# Altium schematic sheet Battery Manager.SchDoc: Battery Manager
size Tabloid; ApprovedBy: NA; CompanyName: Cospan Design LLC; DrawnBy: Dave McCoy; Engineer: Dave McCoy; DocumentNumber: 18; Revision: A; SheetNumber: 18; SheetTotal: 20; Client: Public; ProjectPrettyName: Enigma; Project: Enigma
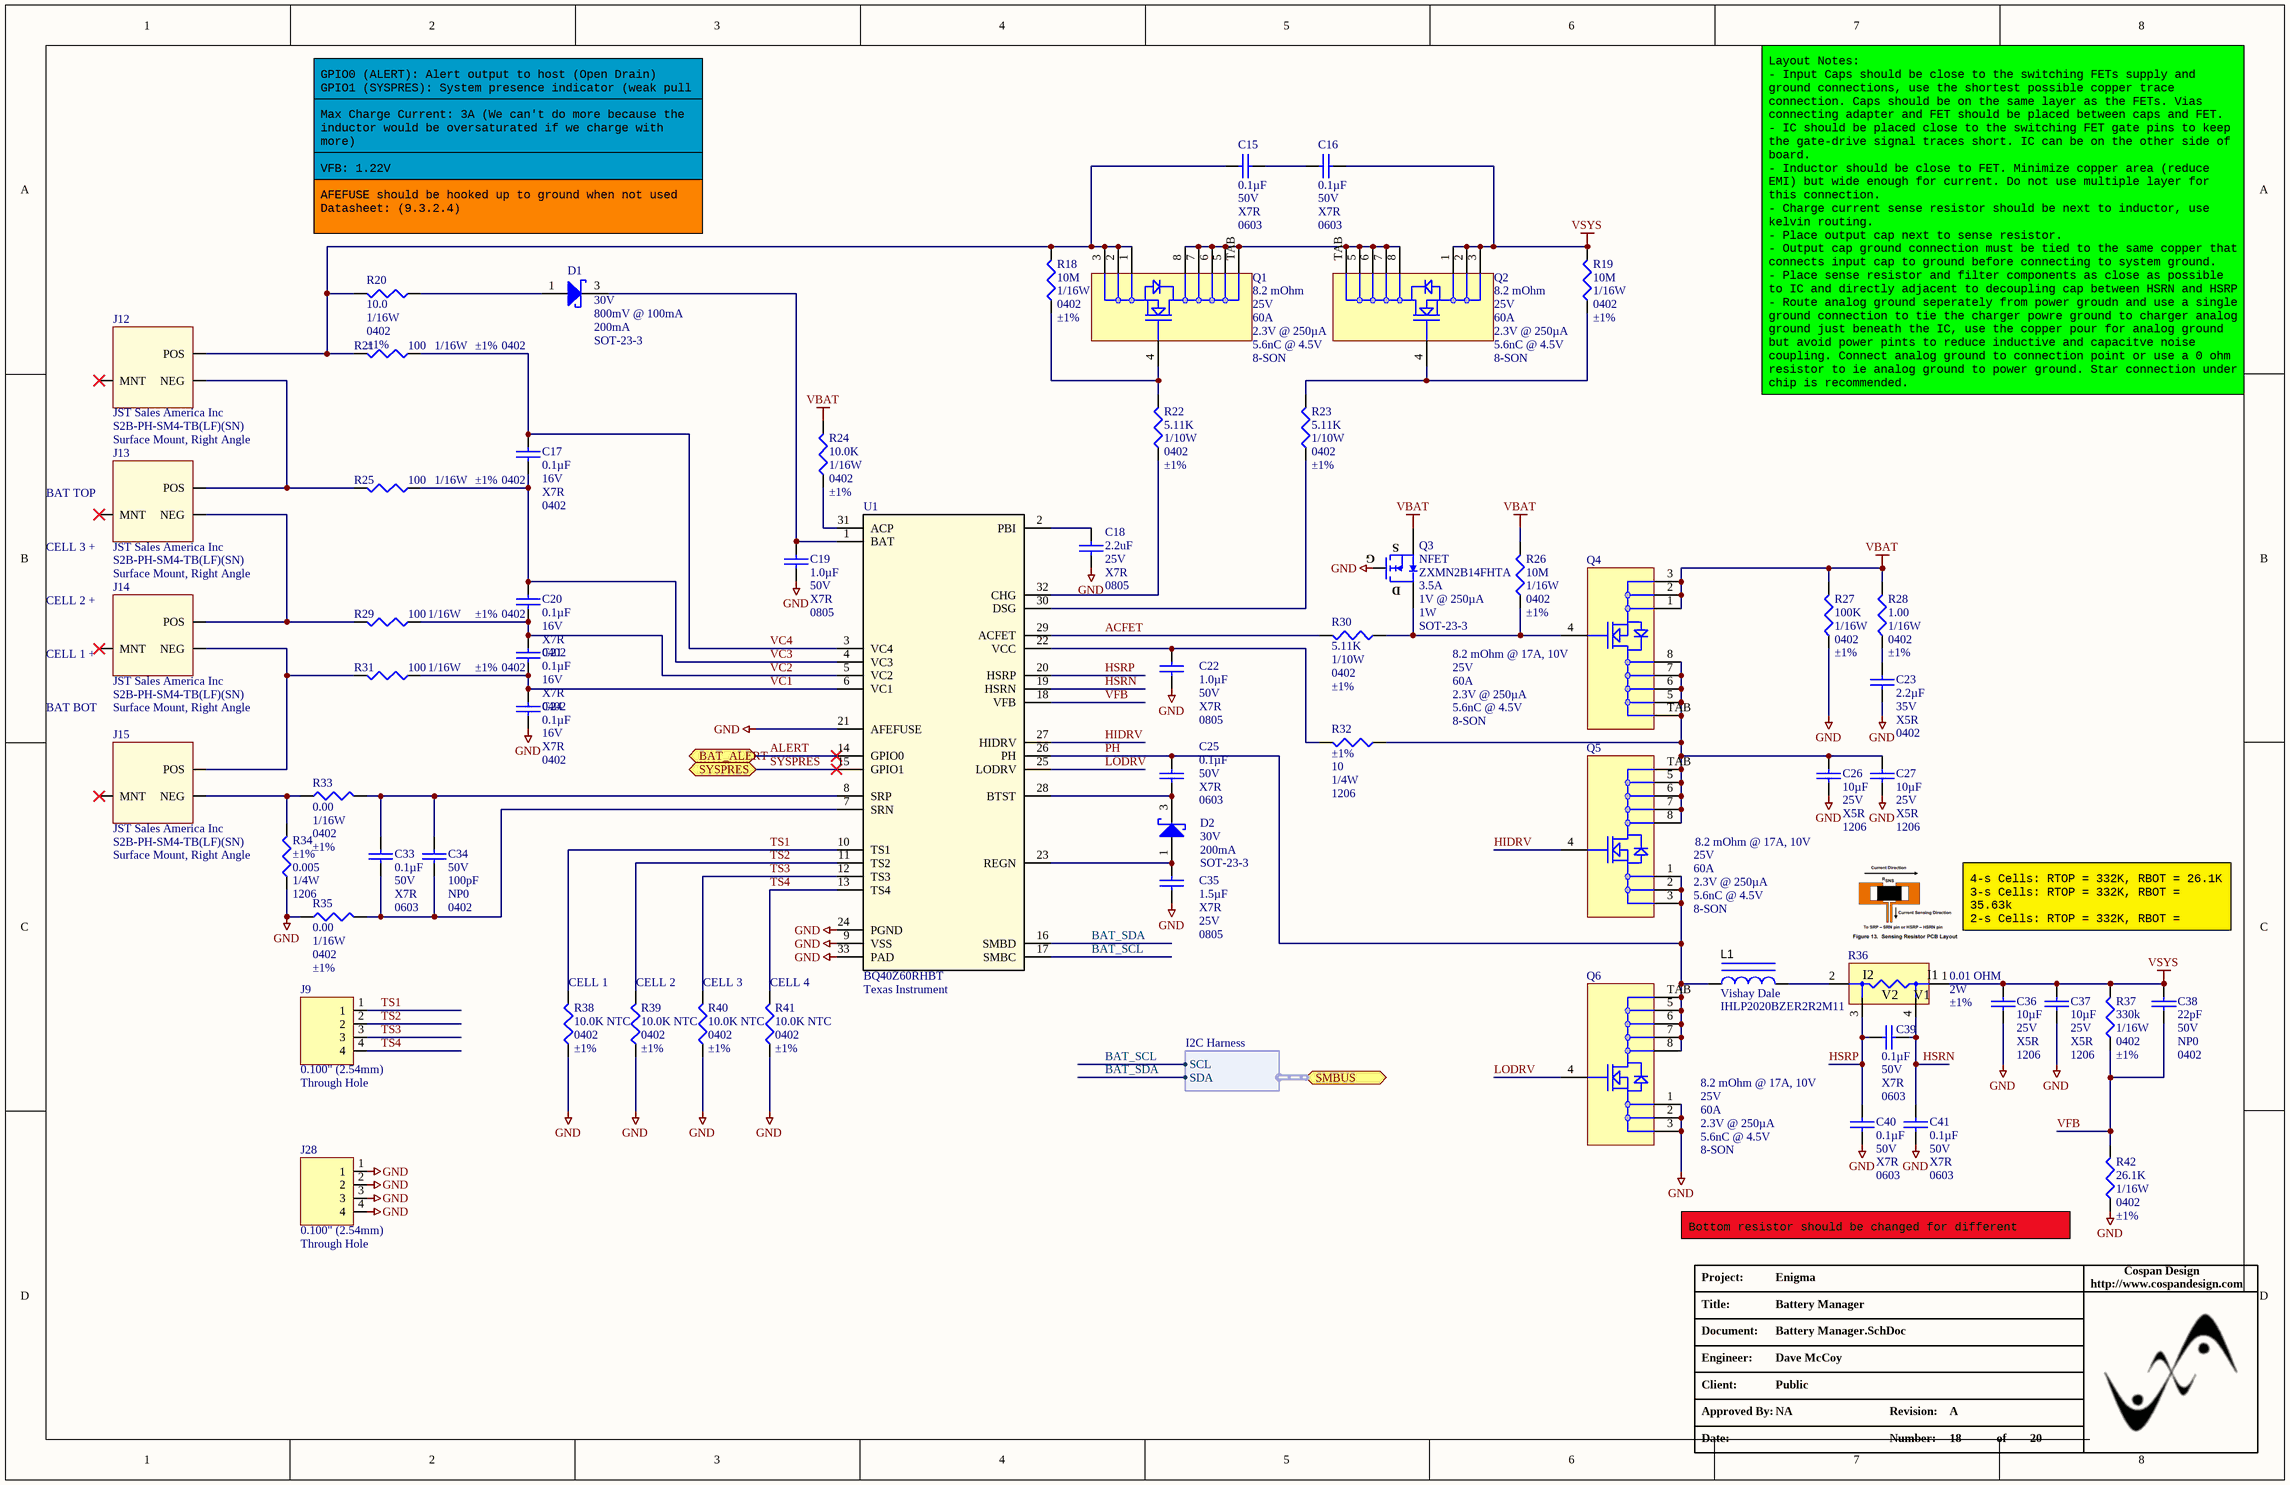
[diagram p0: Battery Manager.SchDoc]

## Parts
C15  Capacitance: 0.1µF  Voltage - Rated: 50V  Temperature Coefficient: X7R  Package / Case: 0603  [C_ERA-0603]  (hidden comment: C_0603_0.1µF)
C16  Capacitance: 0.1µF  Voltage - Rated: 50V  Temperature Coefficient: X7R  Package / Case: 0603  [C_ERA-0603]  (hidden comment: C_0603_0.1µF)
C17  Capacitance: 0.1µF  Voltage - Rated: 16V  Temperature Coefficient: X7R  Package / Case: 0402  [C_0402]  (hidden comment: 0.1uF)
C18  Capacitance: 2.2uF  Voltage - Rated: 25V  Temperature Coefficient: X7R  Package / Case: 0805  [C_ERA-0805]  (hidden comment: C_0805_2.2uF_25V)
C19  Capacitance: 1.0µF  Voltage - Rated: 50V  Temperature Coefficient: X7R  Package / Case: 0805  [C_ERA-0805]  (hidden comment: 1.0uF)
C20  Capacitance: 0.1µF  Voltage - Rated: 16V  Temperature Coefficient: X7R  Package / Case: 0402  [C_0402]  (hidden comment: 0.1uF)
C21  Capacitance: 0.1µF  Voltage - Rated: 16V  Temperature Coefficient: X7R  Package / Case: 0402  [C_0402]  (hidden comment: 0.1uF)
C22  Capacitance: 1.0µF  Voltage - Rated: 50V  Temperature Coefficient: X7R  Package / Case: 0805  [C_ERA-0805]  (hidden comment: 1.0uF)
C23  Capacitance: 2.2µF  Voltage - Rated: 35V  Temperature Coefficient: X5R  Package / Case: 0402  [C_ERA-0402]  (hidden comment: C_0402_2.2uF_35V)
C24  Capacitance: 0.1µF  Voltage - Rated: 16V  Temperature Coefficient: X7R  Package / Case: 0402  [C_0402]  (hidden comment: 0.1uF)
C25  Capacitance: 0.1µF  Voltage - Rated: 50V  Temperature Coefficient: X7R  Package / Case: 0603  [C_ERA-0603]  (hidden comment: C_0603_0.1µF)
C26  Voltage - Rated: 25V  Temperature Coefficient: X5R  Package / Case: 1206  [CAP-1206]  (hidden comment: 10µF)
C27  Voltage - Rated: 25V  Temperature Coefficient: X5R  Package / Case: 1206  [CAP-1206]  (hidden comment: 10µF)
C33  Capacitance: 0.1µF  Voltage - Rated: 50V  Temperature Coefficient: X7R  Package / Case: 0603  [C_ERA-0603]  (hidden comment: C_0603_0.1µF)
C34  Voltage - Rated: 50V  Temperature Coefficient: NP0  Package / Case: 0402  [C_0402]  (hidden comment: 100pF)
C35  Capacitance: 1.5µF  Voltage - Rated: X7R  Temperature Coefficient: 25V  Package / Case: 0805  [C_ERA-0805]  (hidden comment: C_0805_1.5uF_25V)
C36  Voltage - Rated: 25V  Temperature Coefficient: X5R  Package / Case: 1206  [CAP-1206]  (hidden comment: 10µF)
C37  Voltage - Rated: 25V  Temperature Coefficient: X5R  Package / Case: 1206  [CAP-1206]  (hidden comment: 10µF)
C38  Voltage - Rated: 50V  Temperature Coefficient: NP0  Package / Case: 0402  [C_ERA-0402]  (hidden comment: 22pF)
C39  Capacitance: 0.1µF  Voltage - Rated: 50V  Temperature Coefficient: X7R  Package / Case: 0603  [C_ERA-0603]  (hidden comment: C_0603_0.1µF)
C40  Capacitance: 0.1µF  Voltage - Rated: 50V  Temperature Coefficient: X7R  Package / Case: 0603  [C_ERA-0603]  (hidden comment: C_0603_0.1µF)
C41  Capacitance: 0.1µF  Voltage - Rated: 50V  Temperature Coefficient: X7R  Package / Case: 0603  [C_ERA-0603]  (hidden comment: C_0603_0.1µF)
D1  Voltage - DC Reverse (Vr) (Max): 30V  Voltage - Forward (Vf) (Max) @ If: 800mV @ 100mA  Current - Average Rectified (Io): 200mA  Package / Case: SOT-23-3  [SOT23]  (hidden comment: BAT54)
D2  Voltage - DC Reverse (Vr) (Max): 30V  Current - Average Rectified (Io): 200mA  Package / Case: SOT-23-3  [SOT23]  (hidden comment: BAT54)
J9  Pitch: 0.100" (2.54mm)  Mounting Type: Through Hole  [HDR_1X4]  (hidden comment: J_HDR1X4_THRHOLE_VERT)
J12  Manufacturer: JST Sales America Inc  Manufacturer Part Number: S2B-PH-SM4-TB(LF)(SN)  Mounting Type: Surface Mount, Right Angle  [HDR_1X2_LIPO_BATTERY]  (hidden comment: J_LIPO_BAT_CONNECTOR)
J13  Manufacturer: JST Sales America Inc  Manufacturer Part Number: S2B-PH-SM4-TB(LF)(SN)  Mounting Type: Surface Mount, Right Angle  [HDR_1X2_LIPO_BATTERY]  (hidden comment: J_LIPO_BAT_CONNECTOR)
J14  Manufacturer: JST Sales America Inc  Manufacturer Part Number: S2B-PH-SM4-TB(LF)(SN)  Mounting Type: Surface Mount, Right Angle  [HDR_1X2_LIPO_BATTERY]  (hidden comment: J_LIPO_BAT_CONNECTOR)
J15  Manufacturer: JST Sales America Inc  Manufacturer Part Number: S2B-PH-SM4-TB(LF)(SN)  Mounting Type: Surface Mount, Right Angle  [HDR_1X2_LIPO_BATTERY]  (hidden comment: J_LIPO_BAT_CONNECTOR)
J28  Pitch: 0.100" (2.54mm)  Mounting Type: Through Hole  [HDR_1X4]  (hidden comment: J_HDR1X4_THRHOLE_VERT)
L1  Manufacturer: Vishay Dale  Manufacturer Part Number: IHLP2020BZER2R2M11  [IHLP-2020BZ]  (hidden comment: L_IHLP2020BZER2R2M11)
Q1  Rds On (Max) @ Id, Vgs: 8.2 mOhm  Drain to Source Voltage (Vdss): 25V  Current - Continuous Drain (Id) @ 25° C: 60A  Vgs(th) (Max) @ Id: 2.3V @ 250µA  Gate Charge (Qg) @ Vgs: 5.6nC @ 4.5V  Package / Case: 8-SON  [Q_TDSON-8 NexFET]  (hidden comment: N-Channel Nex_FET)
Q2  Rds On (Max) @ Id, Vgs: 8.2 mOhm  Drain to Source Voltage (Vdss): 25V  Current - Continuous Drain (Id) @ 25° C: 60A  Vgs(th) (Max) @ Id: 2.3V @ 250µA  Gate Charge (Qg) @ Vgs: 5.6nC @ 4.5V  Package / Case: 8-SON  [Q_TDSON-8 NexFET]  (hidden comment: N-Channel Nex_FET)
Q3  NFET  Manufacturer Part Number: ZXMN2B14FHTA  Current - Continuous Drain (Id) @ 25° C: 3.5A  Vgs(th) (Max) @ Id: 1V @ 250µA  Power - Max: 1W  Package / Case: SOT-23-3  [SOT-23A]
Q4  Rds On (Max) @ Id, Vgs: 8.2 mOhm @ 17A, 10V  Drain to Source Voltage (Vdss): 25V  Current - Continuous Drain (Id) @ 25° C: 60A  Vgs(th) (Max) @ Id: 2.3V @ 250µA  Gate Charge (Qg) @ Vgs: 5.6nC @ 4.5V  Package / Case: 8-SON  [Q_TDSON-8 NexFET]  (hidden comment: N-Channel Nex_FET)
Q5  Rds On (Max) @ Id, Vgs: 8.2 mOhm @ 17A, 10V  Drain to Source Voltage (Vdss): 25V  Current - Continuous Drain (Id) @ 25° C: 60A  Vgs(th) (Max) @ Id: 2.3V @ 250µA  Gate Charge (Qg) @ Vgs: 5.6nC @ 4.5V  Package / Case: 8-SON  [Q_TDSON-8 NexFET]  (hidden comment: N-Channel Nex_FET)
Q6  Rds On (Max) @ Id, Vgs: 8.2 mOhm @ 17A, 10V  Drain to Source Voltage (Vdss): 25V  Current - Continuous Drain (Id) @ 25° C: 60A  Vgs(th) (Max) @ Id: 2.3V @ 250µA  Gate Charge (Qg) @ Vgs: 5.6nC @ 4.5V  Package / Case: 8-SON  [Q_TDSON-8 NexFET]  (hidden comment: N-Channel Nex_FET)
R18  Resistance In Ohms: 10M  Power (Watts): 1/16W  Case: 0402  Tolerance: ±1%  [R_0402]  (hidden comment: R_0402_10M)
R19  Resistance In Ohms: 10M  Power (Watts): 1/16W  Case: 0402  Tolerance: ±1%  [R_0402]  (hidden comment: R_0402_10M)
R20  Resistance In Ohms: 10.0  Power (Watts): 1/16W  Case: 0402  Tolerance: ±1%  [R_0402]  (hidden comment: R_0402_10.0)
R21  Case: 0402  Resistance In Ohms: 100  Power (Watts): 1/16W  Tolerance: ±1%  [R_0402]  (hidden comment: R_0402_100.0)
R22  Resistance In Ohms: 5.11K  Power (Watts): 1/10W  Case: 0402  Tolerance: ±1%  [R_0402]  (hidden comment: 5.11k Ohms)
R23  Resistance In Ohms: 5.11K  Power (Watts): 1/10W  Case: 0402  Tolerance: ±1%  [R_0402]  (hidden comment: 5.11k Ohms)
R24  Resistance In Ohms: 10.0K  Power (Watts): 1/16W  Case: 0402  Tolerance: ±1%  [R_0402]  (hidden comment: R_0402_10.0K)
R25  Case: 0402  Resistance In Ohms: 100  Power (Watts): 1/16W  Tolerance: ±1%  [R_0402]  (hidden comment: R_0402_100.0)
R26  Resistance In Ohms: 10M  Power (Watts): 1/16W  Case: 0402  Tolerance: ±1%  [R_0402]  (hidden comment: R_0402_10M)
R27  Resistance In Ohms: 100K  Power (Watts): 1/16W  Case: 0402  Tolerance: ±1%  [R_0402]  (hidden comment: R_0402_100.0K)
R28  Resistance In Ohms: 1.00  Power (Watts): 1/16W  Case: 0402  Tolerance: ±1%  [R_0402]  (hidden comment: 1.0 Ohms)
R29  Case: 0402  Resistance In Ohms: 100  Power (Watts): 1/16W  Tolerance: ±1%  [R_0402]  (hidden comment: R_0402_100.0)
R30  Resistance In Ohms: 5.11K  Power (Watts): 1/10W  Case: 0402  Tolerance: ±1%  [R_0402]  (hidden comment: 5.11k Ohms)
R31  Case: 0402  Resistance In Ohms: 100  Power (Watts): 1/16W  Tolerance: ±1%  [R_0402]  (hidden comment: R_0402_100.0)
R32  Tolerance: ±1%  Resistance In Ohms: 10  Power (Watts): 1/4W  Case: 1206  [R_1206]  (hidden comment: R_1206_10)
R33  Resistance In Ohms: 0.00  Power (Watts): 1/16W  Case: 0402  Tolerance: ±1%  [R_0402]  (hidden comment: 0.0 Ohms)
R34  Tolerance: ±1%  Resistance In Ohms: 0.005  Power (Watts): 1/4W  Case: 1206  [R_1206]  (hidden comment: R_1206_0.005)
R35  Resistance In Ohms: 0.00  Power (Watts): 1/16W  Case: 0402  Tolerance: ±1%  [R_0402]  (hidden comment: 0.0 Ohms)
R36  0.01 OHM  Power (Watts): 2W  Tolerance: ±1%  [R_LVK25_0.003]
R37  Resistance In Ohms: 330k  Power (Watts): 1/16W  Case: 0402  Tolerance: ±1%  [R_0402]  (hidden comment: R_0402_330K)
R38  Resistance In Ohms: 10.0K NTC  Case: 0402  Tolerance: ±1%  [R_0402]  (hidden comment: R_0402_NTC_10.0K)
R39  Resistance In Ohms: 10.0K NTC  Case: 0402  Tolerance: ±1%  [R_0402]  (hidden comment: R_0402_NTC_10.0K)
R40  Resistance In Ohms: 10.0K NTC  Case: 0402  Tolerance: ±1%  [R_0402]  (hidden comment: R_0402_NTC_10.0K)
R41  Resistance In Ohms: 10.0K NTC  Case: 0402  Tolerance: ±1%  [R_0402]  (hidden comment: R_0402_NTC_10.0K)
R42  Resistance In Ohms: 26.1K  Power (Watts): 1/16W  Case: 0402  Tolerance: ±1%  [R_0402]  (hidden comment: R_0402_26.1K)
U1  Manufacturer Part Number: BQ40Z60RHBT  Manufacturer: Texas Instrument  [RHB0032E]  (hidden comment: U_BQ40Z60RHBR)

## Ports
BAT_ALERT, SMBUS (harness I2C Harness), SYSPRES

## Harnesses
I2C Harness: SCL, SDA

## Nets
GND: C18.1 C19.1 C22.1 C23.1 C24.2 C26.1 C27.1 C35.1 C36.2 C37.2 C40.2 C41.2 J28.1 J28.2 J28.3 J28.4 Q3.1(G) Q6.1(S1) Q6.2 Q6.3 R27.2 R34.2 R35.2 R38.2 R39.2 R40.2 R41.2 R42.2 U1.9(VSS) U1.21(AFEFUSE) U1.24(PGND) U1.33(PAD)
VBAT: Q3.2(S) Q4.1(S1) Q4.2 Q4.3 R24.1 R26.1 R27.1 R28.1
VSYS: C16.1 C36.1 C37.1 C38.2 Q2.1(S1) Q2.2 Q2.3 R19.1 R36.1(I1) R37.1
ACFET: R30.1 U1.29(ACFET)
ALERT: U1.14(GPIO0) ; port BAT_ALERT
BAT_SCL: U1.17(SMBC) ; port SMBUS.SCL
BAT_SDA: U1.16(SMBD) ; port SMBUS.SDA
HIDRV: Q5.4(G1) U1.27(HIDRV)
HSRN: C39.2 C41.1 R36.4(V1) U1.19(HSRN)
HSRP: C39.1 C40.1 R36.3(V2) U1.20(HSRP)
LODRV: Q6.4(G1) U1.25(LODRV)
PH: C25.1 L1.2 Q5.1(S1) Q5.2 Q5.3 Q6.5 Q6.6 Q6.7(D2a) Q6.8(D2b) Q6.TAB U1.26(PH)
SYSPRES: U1.15(GPIO1) ; port SYSPRES
TS1: J9.1 R38.1 U1.10(TS1)
TS2: J9.2 R39.1 U1.11(TS2)
TS3: J9.3 R40.1 U1.12(TS3)
TS4: J9.4 R41.1 U1.13(TS4)
VC1: C21.2 C24.1 R31.2 U1.6(VC1)
VC2: C20.2 C21.1 R29.2 U1.5(VC2)
VC3: C17.2 C20.1 R25.2 U1.4(VC3)
VC4: C17.1 R21.2 U1.3(VC4)
VFB: C38.1 R37.2 R42.1 U1.18(VFB)
NetC15_1: C15.1 C16.2
NetC15_2: C15.2 J12.1(POS) Q1.1(S1) Q1.2 Q1.3 R18.1 R20.1 R21.1
NetC18_2: C18.2 U1.2(PBI)
NetC19_2: C19.2 D1.3(K) U1.1(BAT)
NetC22_2: C22.2 R32.1 U1.22(VCC)
NetC23_2: C23.2 R28.2
NetC25_2: C25.2 D2.3(K) U1.28(BTST)
NetC26_2: C26.2 C27.2 Q4.5 Q4.6 Q4.7(D2a) Q4.8(D2b) Q4.TAB Q5.5 Q5.6 Q5.7(D2a) Q5.8(D2b) Q5.TAB R32.2
NetC33_1: C33.1 C34.1 R35.1 U1.7(SRN)
NetC33_2: C33.2 C34.2 R33.1 U1.8(SRP)
NetC35_2: C35.2 D2.1(A) U1.23(REGN)
NetD1_1: D1.1(A) R20.2
NetJ12_2: J12.2(NEG) J13.1(POS) R25.1
NetJ13_2: J13.2(NEG) J14.1(POS) R29.1
NetJ14_2: J14.2(NEG) J15.1(POS) R31.1
NetJ15_2: J15.2(NEG) R33.2 R34.1
NetL1_1: L1.1 R36.2(I2)
NetQ1_4: Q1.4(G1) R18.2 R22.1
NetQ1_5: Q1.5 Q1.6 Q1.7(D2a) Q1.8(D2b) Q1.TAB Q2.5 Q2.6 Q2.7(D2a) Q2.8(D2b) Q2.TAB
NetQ2_4: Q2.4(G1) R19.2 R23.1
NetQ3_3: Q3.3(D) Q4.4(G1) R26.2 R30.2
NetR22_2: R22.2 U1.32(CHG)
NetR23_2: R23.2 U1.30(DSG)
NetR24_2: R24.2 U1.31(ACP)

Not connected (* = marked no-connect by the designer): J12 MNT*; J13 MNT*; J14 MNT*; J15 MNT*

## Notes on the sheet
- GPIO0 (ALERT): Alert output to host (Open Drain)
  GPIO1 (SYSPRES): System presence indicator (weak pull up)
- Max Charge Current: 3A (We can't do more because the inductor would be oversaturated if we charge with more)
- VFB: 1.22V
- AFEFUSE should be hooked up to ground when not used
  Datasheet: (9.3.2.4)
- Layout Notes:
  - Input Caps should be close to the switching FETs supply and ground connections, use the shortest possible copper trace connection. Caps should be on the same layer as the FETs. Vias connecting adapter and FET should be placed between caps and FET.
  - IC should be placed close to the switching FET gate pins to keep the gate-drive signal traces short. IC can be on the other side of board.
  - Inductor should be close to FET. Minimize copper area (reduce EMI) but wide enough for current. Do not use multiple layer for this connection.
  - Charge current sense resistor should be next to inductor, use kelvin routing.
  - Place output cap next to sense resistor.
  - Output cap ground connection must be tied to the same copper that connects input cap to ground before connecting to system ground.
  - Place sense resistor and filter components as close as possible to IC and directly adjacent to decoupling cap between HSRN and HSRP
  - Route analog ground seperately from power groudn and use a single ground connection to tie the charger powre ground to charger analog ground just beneath the IC, use the copper pour for analog ground but avoid power pints to reduce inductive and capacitve noise coupling. Connect analog ground to connection point or use a 0 ohm resistor to ie analog ground to power ground. Star connection under chip is recommended.
  - It is critical that the exposed thermal pad on the back side of the IC package be soldered t othe PCB ground.
- (near J13) BAT TOP
- (near J13) CELL 3 +
- (near J14) CELL 2 +
- (near J14) CELL 1 +
- BAT BOT
- 4-s Cells: RTOP = 332K, RBOT = 26.1K
  3-s Cells: RTOP = 332K, RBOT = 35.63k
  2-s Cells: RTOP = 332K, RBOT = 56.13K
- (near R38) CELL 1
- (near R39) CELL 2
- (near R40) CELL 3
- (near R41) CELL 4
- (near R42) Bottom resistor should be changed for different batteries
- Project:
- http://www.cospandesign.com
- Cospan Design
- Document:
- Engineer:
- Title:
- Client:
- Approved By:
- Revision:
- Date:
- Number:
- of

## Library data of the parts
C15 C16 C25 C33 C39-C41 = C_0603_0.1µF: CAP CER 0.1UF 50V X7R 0603; Manufacturer: Samsung Electro-Mechanics America, Inc.; Manufacturer Part Number: CL10B104KB8SFNC; Tolerance: ±10%; Supplier 1: Digi-Key; RoHS: RoHS Compliant; Category: Capacitors; Stock 1: 1364172; Pricing 1: 1=0.1, 10=0.027, 25=0.0192, 50=0.0148, 100=0.0125, 500=0.00874, 1000=0.00681 (USD); Packaging: Cut Tape (CT); Mounting Type: Surface Mount, MLCC; Operating Temperature: -55°C ~ 125°C; Applications: Boardflex Sensitive; Ratings: -; Size / Dimension: 0.063" L x 0.031" W (1.60mm x 0.80mm); Height - Seated (Max): -; Thickness (Max): 0.035" (0.90mm); Lead Spacing: -; Features: Soft Termination; Lead Style: -; ComponentLink1URL: http://www.samsungsem.com/kr/support/product-search/mlcc/CL10B104KB8SFNC.jsp; ComponentLink1Description: http://www.samsungsem.com/kr/support/product-search/mlcc/CL10B104KB8SFNC.jsp; Supplier Part Number 1: 1276-1936-1-ND; Supplier 2: Digi-Key; Stock 2: 470947; Pricing 2: 1=0.1, 10=0.026, 50=0.0144, 100=0.0121, 250=0.00992, 500=0.00848, 1000=0.0066 (USD); ComponentLink2URL: http://www.kemet.com/docfinder?Partnumber=C0603C104M5RACTU; ComponentLink2Description: http://www.kemet.com/docfinder?Partnumber=C0603C104M5RACTU; Supplier Part Number 2: 399-7845-1-ND
C17 C20 C21 C24 = C_0402_0.1UF_16V: CAP CER .10UF 16V X7R 0402; Manufacturer: Murata Electronics North America; Manufacturer Part Number: GRM155R71C104KA88J; Tolerance: ±10%; Description: CAP CER 0.1UF 16V X7R 0402; Supplier 1: Digi-Key; Supplier Part Number 1: 490-6328-1-ND; RoHS: RoHS Compliant; Category: Capacitors; Stock 1: 18103134; Mounting Type: Surface Mount, MLCC; Features: -; Lead Spacing: -; Packaging: Cut Tape (CT); ComponentLink1URL: http://www.murata.com/~/media/webrenewal/support/library/catalog/products/capacitor/mlcc/c02e.ashx?la=en-us; ComponentLink1Description: http://www.murata.com/~/media/webrenewal/support/library/catalog/products/capacitor/mlcc/c02e.ashx?la=en-us; Operating Temperature: -55°C ~ 125°C; Pricing 1: 1=0.1, 10=0.014, 100=0.0062, 500=0.00442, 1000=0.00348, 2500=0.00316, 5000=0.00291 (USD); Part Status: Active; Ratings: -; Applications: General Purpose; Size / Dimension: 0.039" L x 0.020" W (1.00mm x 0.50mm); Height - Seated (Max): -; Thickness (Max): 0.022" (0.55mm)
C18 = C_0805_2.2uF_25V: Manufacturer: Taiyo Yuden; Manufacturer Part Number: TMK212B7225KG-TR; Tolerance: ±10%; Supplier 1: Digi-Key; RoHS: RoHS Compliant; Category: Capacitors; Stock 1: 119541; Pricing 1: 1=0.34, 10=0.255, 50=0.1488, 100=0.119, 250=0.085, 500=0.0578, 1000=0.04675 (USD); Packaging: Cut Tape (CT); Part Status: Active; Operating Temperature: -55°C ~ 125°C; Features: -; Ratings: -; Applications: General Purpose; Failure Rate: *; Mounting Type: Surface Mount, MLCC; Size / Dimension: 0.079" L x 0.049" W (2.00mm x 1.25mm); Height - Seated (Max): -; Thickness (Max): 0.053" (1.35mm); Lead Spacing: -; Lead Style: -; ComponentLink1URL: http://ds.yuden.co.jp/TYCOMPAS/ut/detail.do?productNo=TMK212B7225KG-TR&fileName=TMK212B7225KG-TR_SS&mode=specSheetDownload; ComponentLink1Description: http://ds.yuden.co.jp/TYCOMPAS/ut/detail.do?productNo=TMK212B7225KG-TR&fileName=TMK212B7225KG-TR_SS&mode=specSheetDownload; Supplier Part Number 1: 587-2991-1-ND
C19 C22 = C_0805_1.0uF_50V: CAP CER 1UF 50V X7R 0805; Manufacturer: Murata Electronics North America; Manufacturer Part Number: GRM21BR71H105KA12L; Tolerance: ±10%; Supplier 1: Digi-Key; RoHS: RoHS Compliant; Category: Capacitors; Stock 1: 322160; Pricing 1: 10=0.529, 100=0.3127, 500=0.18038, 1000=0.12506 (USD); Mounting Type: Surface Mount, MLCC; Operating Temperature: -55°C ~ 125°C; Features: -; Applications: General Purpose; Ratings: -; Size / Dimension: 0.079" L x 0.049" W (2.00mm x 1.25mm); Lead Spacing: -; Thickness: 1.25mm; Packaging: Cut Tape (CT); Lead Style: -; ComponentLink1URL: http://search.murata.co.jp/Ceramy/image/img/PDF/ENG/GRM21BR71H105KA12.pdf; ComponentLink1Description: http://search.murata.co.jp/Ceramy/image/img/PDF/ENG/GRM21BR71H105KA12.pdf; Supplier Part Number 1: 490-4736-1-ND
C23 = C_0402_2.2uF_35V: CAP CER 2.2UF 35V 20% X5R 0402; Manufacturer: TDK Corporation; Manufacturer Part Number: C1005X5R1V225K050BC; Tolerance: ±10%; Description: CAP CER 2.2UF 35V X5R 0402; Supplier 1: Digi-Key; Supplier Part Number 1: 445-9028-1-ND; RoHS: RoHS Compliant; Category: Capacitors; Stock 1: 300469; Packaging: Cut Tape (CT); Mounting Type: Surface Mount, MLCC; Operating Temperature: -55°C ~ 85°C; Applications: General Purpose; Ratings: -; Size / Dimension: 0.039" L x 0.020" W (1.00mm x 0.50mm); Height - Seated (Max): -; Thickness (Max): 0.022" (0.55mm); Lead Spacing: -; Features: Low ESL; Lead Style: -; ComponentLink1URL: https://product.tdk.com/info/en/catalog/datasheets/mlcc_commercial_general_en.pdf; ComponentLink1Description: https://product.tdk.com/info/en/catalog/datasheets/mlcc_commercial_general_en.pdf; Pricing 1: 1=0.36, 10=0.253, 100=0.1518, 500=0.11386, 1000=0.09614, 2500=0.09108, 5000=0.08602 (USD); Part Status: Active; Failure Rate: -
C26 C27 C36 C37 = C_1206_10UF_25V: CAP CER 10UF 25V X5R 1206; Manufacturer: Murata Electronics North America; Manufacturer Part Number: GRM31CR61E106MA12L; Tolerance: ±20%; Supplier 1: Digi-Key; Supplier Part Number 1: 490-5423-1-ND; RoHS: RoHS Compliant; Category: Capacitors; Stock 1: 359069; Pricing: 1=0.51, 10=0.402, 50=0.2646, 100=0.2099, 250=0.15512, 500=0.12046, 1000=0.0949 (USD); Mounting Type: Surface Mount, MLCC; Operating Temperature: -55°C ~ 85°C; Applications: General Purpose; Ratings: -; Size / Dimension: 0.126" L x 0.063" W (3.20mm x 1.60mm); Height: -; Thickness: 0.071" (1.80mm); Lead Spacing: -; Features: -; Packaging: Cut Tape (CT); Lead Style: -; ComponentLink1URL: http://search.murata.co.jp/Ceramy/image/img/PDF/ENG/GRM31CR61E106MA12.pdf; ComponentLink1Description: http://search.murata.co.jp/Ceramy/image/img/PDF/ENG/GRM31CR61E106MA12.pdf; Capacitance: 10µF
C34 = C_0402_100PF: CAP CER 100PF 50V 5% C0G 0402; Manufacturer: Murata Electronics North America; Manufacturer Part Number: GRM1555C1H101JA01D; Supplier 1: Digi-Key; Supplier Part Number 1: 490-5922-1-ND; RoHS: RoHS Compliant; Category: Capacitors; Stock 1: 1663893; Tolerance: ±5%; Mounting Type: Surface Mount, MLCC; Operating Temperature: -55°C ~ 125°C; Applications: General Purpose; Ratings: -; Size / Dimension: 0.039" L x 0.020" W (1.00mm x 0.50mm); Lead Spacing: -; Features: -; Packaging: Cut Tape (CT); Lead Style: -; ComponentLink1URL: http://www.murata.com/~/media/webrenewal/support/library/catalog/products/capacitor/mlcc/c02e.pdf; ComponentLink1Description: http://www.murata.com/~/media/webrenewal/support/library/catalog/products/capacitor/mlcc/c02e.pdf; Capacitance: 100pF; Pricing 1: 1=0.1, 10=0.012, 50=0.0066, 100=0.0055, 250=0.00452, 500=0.00386, 1000=0.003, 5000=0.0025 (USD); Part Status: Active; Failure Rate: *; Height - Seated (Max): -; Thickness (Max): 0.022" (0.55mm)
C35 = C_0805_1.5uF_25V: 1.5µF ±10% 25V Ceramic Capacitor X7R 0805 (2012 Metric); Manufacturer: Murata Electronics North America; Manufacturer Part Number: GRM21BR71E155KA88L; Supplier 1: Digi-Key; RoHS: RoHS Compliant; Category: Capacitors; Stock 1: 7266; Pricing 1: 1=0.29, 10=0.24, 50=0.135, 100=0.12, 250=0.09, 500=0.0795, 1000=0.0705 (USD); Packaging: Cut Tape (CT); Part Status: Active; Tolerance: ±10%; Operating Temperature: -55°C ~ 125°C; Features: -; Ratings: -; Applications: General Purpose; Failure Rate: *; Mounting Type: Surface Mount, MLCC; Size / Dimension: 0.079" L x 0.049" W (2.00mm x 1.25mm); Height - Seated (Max): -; Thickness (Max): 0.053" (1.35mm); Lead Spacing: -; Lead Style: -; ComponentLink1URL: http://www.murata.com/~/media/webrenewal/support/library/catalog/products/capacitor/mlcc/c02e.pdf; ComponentLink1Description: http://www.murata.com/~/media/webrenewal/support/library/catalog/products/capacitor/mlcc/c02e.pdf; Supplier Part Number 1: 490-3330-1-ND
C38 = C_0402_22PF_50V: CAP CER 22PF 50V NP0 0402; Manufacturer: Murata Electronics North America; Manufacturer Part Number: GRM1555C1H220FA01D; Tolerance: ±1%; Description: CAP CER 22PF 50V C0G/NP0 0402; Supplier 1: Digi-Key; Supplier Part Number 1: 490-8589-1-ND; RoHS: RoHS Compliant; Category: Capacitors; Stock 1: 606100; Mounting Type: Surface Mount, MLCC; Operating Temperature: -55°C ~ 125°C; Applications: General Purpose; Ratings: -; Size / Dimension: 0.039" L x 0.020" W (1.00mm x 0.50mm); Height - Seated (Max): -; Thickness (Max): 0.022" (0.55mm); Lead Spacing: -; Features: -; Packaging: Cut Tape (CT); Lead Style: -; ComponentLink1URL: http://search.murata.co.jp/Ceramy/image/img/A01X/G101/ENG/GRM1555C1H220FA01-01.pdf; ComponentLink1Description: http://search.murata.co.jp/Ceramy/image/img/A01X/G101/ENG/GRM1555C1H220FA01-01.pdf; Capacitance: 22pF; Pricing 1: 1=0.1, 10=0.05, 100=0.0223, 500=0.01594, 1000=0.01252, 2500=0.01138, 5000=0.01047 (USD); Part Status: Active
D1 = D_SCHOTT_BAT54: DIODE SCHOTTKY 30V 200MA SOT-23; Manufacturer: Fairchild Semiconductor; Speed: Small Signal =< 200mA (Io), Any Speed; Reverse Recovery Time (trr): 5ns; Current - Reverse Leakage @ Vr: 2µA @ 25V; Capacitance @ Vr, F: 10pF @ 1V, 1MHz; Supplier 1: Digi-Key; Supplier Part Number 1: BAT54FSCT-ND; Manufacturer Part Number: BAT54; RoHS: RoHS Compliant; Category: Discrete Semiconductor Products; Stock 1: 200821; Pricing: 1=0.17, 10=0.154, 25=0.1404, 100=0.101, 250=0.05952, 500=0.04938, 1000=0.03368 (USD); Diode Type: Schottky; Mounting Type: Surface Mount; Supplier Device Package: SOT-23-3 (TO-236); Packaging: Cut Tape (CT); ComponentLink1URL: http://www.fairchildsemi.com/ds/BA/BAT54.pdf; ComponentLink1Description: http://www.fairchildsemi.com/ds/BA/BAT54.pdf
D2 = D_SCHOTT_BAT54: DIODE SCHOTTKY 30V 200MA SOT-23; Manufacturer: Fairchild Semiconductor; Speed: Small Signal =< 200mA (Io), Any Speed; Reverse Recovery Time (trr): 5ns; Current - Reverse Leakage @ Vr: 2µA @ 25V; Capacitance @ Vr, F: 10pF @ 1V, 1MHz; Voltage - Forward (Vf) (Max) @ If: 800mV @ 100mA; Supplier 1: Digi-Key; Supplier Part Number 1: BAT54FSCT-ND; Manufacturer Part Number: BAT54; RoHS: RoHS Compliant; Category: Discrete Semiconductor Products; Stock 1: 200821; Pricing: 1=0.17, 10=0.154, 25=0.1404, 100=0.101, 250=0.05952, 500=0.04938, 1000=0.03368 (USD); Diode Type: Schottky; Mounting Type: Surface Mount; Supplier Device Package: SOT-23-3 (TO-236); Packaging: Cut Tape (CT); ComponentLink1URL: http://www.fairchildsemi.com/ds/BA/BAT54.pdf; ComponentLink1Description: http://www.fairchildsemi.com/ds/BA/BAT54.pdf
J9 J28 = J_HDR1X4_THRHOLE_VERT: CONN HEADER .100" 4POS TIN PCB; Manufacturer: Samtec; Manufacturer Part Number: TSW-104-07-T-S; Connector Type: Unshrouded; Number of Positions: 4; Number of Positions Loaded: All; Supplier 1: Samtec; Supplier Part Number 1: TSW-104-07-T-S; RoHS: RoHS Compliant; Category: Connectors, Interconnects; Number of Rows: 1; Row Spacing: -; Height Stacking (Mating): -; Height Above Board: 0.100" (2.54mm); Contact Mating Length: 0.166" (4.22mm); Termination: Solder; Contact Finish: Tin; Contact Finish Thickness: 200µin (5.08µm); Features: -; Color: Black; Packaging: Bulk; ComponentLink1URL: http://www.samtec.com/ftppub/cpdf/TX-MKT1.PDF; ComponentLink1Description: http://www.samtec.com/ftppub/cpdf/TX-MKT1.PDF; Pricing: 1=0.134
J12-J15 = J_LIPO_BAT_CONNECTOR: CONN HEADER PH SIDE 2POS 2MM SMD; Connector Type: Header, Shrouded; Number of Positions: 2; Number of Positions Loaded: All; Pitch: 0.079" (2.00mm); Supplier 1: Digi-Key; Supplier Part Number 1: 455-1749-1-ND; RoHS: RoHS Compliant; Category: Connectors, Interconnects; Stock 1: 29466; Pricing: 1=0.51, 10=0.474, 100=0.3947, 500=0.31576 (USD); Contact Type: Male Pin; Number of Rows: 1; Row Spacing: -; Contact Mating Length: -; Termination: Solder; Fastening Type: -; Features: Solder Retention; Contact Finish: Tin; Contact Finish Thickness: -; Color: Natural; Packaging: Cut Tape (CT); ComponentLink1URL: http://www.jst-mfg.com/product/pdf/eng/ePH.pdf; ComponentLink1Description: http://www.jst-mfg.com/product/pdf/eng/ePH.pdf
L1 = L_IHLP2020BZER2R2M11: 2.2µH Shielded Molded Inductor 5A 37.7 mOhm Max; Tolerance: ±20%; Description: FIXED IND 2.2UH 5A 37.7 MOHM SMD; Supplier 1: Digi-Key; RoHS: RoHS Compliant; Category: Inductors, Coils, Chokes; Stock 1: 9448; Pricing 1: 1=2.39, 10=2.208, 100=1.5456, 500=1.2512, 1000=1.1408 (USD); Packaging: Cut Tape (CT); Part Status: Active; Type: Molded; Material - Core: -; Shielding: Shielded; DC Resistance (DCR): 37.7 mOhm Max; Q @ Freq: -; Ratings: -; Operating Temperature: -55°C ~ 125°C; Mounting Type: Surface Mount; Package / Case: Nonstandard; Size / Dimension: 0.216" L x 0.204" W (5.49mm x 5.18mm); Height - Seated (Max): 0.079" (2.00mm); ComponentLink1URL: http://www.vishay.com/docs/34261/ihlp2020bz11.pdf; ComponentLink1Description: http://www.vishay.com/docs/34261/ihlp2020bz11.pdf; Supplier Part Number 1: 541-1220-1-ND; Supplier Device Package: -
Q1 Q2 Q4-Q6 = Q_N-CH_8SON_60A_9.5mOHM: MOSFET N-CH 25V 60A 8-SON; Manufacturer: Texas Instruments; Manufacturer Part Number: CSD16409Q3; FET Type: MOSFET N-Channel, Metal Oxide; FET Feature: Logic Level Gate; Input Capacitance (Ciss) @ Vds: 800pF @ 12.5V; Power - Max: 2.6W; Supplier 1: Digi-Key; Supplier Part Number 1: 296-24253-1-ND; RoHS: RoHS Compliant By Exemption; Category: Discrete Semiconductor Products; Stock 1: 39445; Pricing: 1=1.72, 25=1.356, 100=1.2204, 250=1.0622, 500=0.9492, 1000=0.7458 (USD); Mounting Type: Surface Mount; Supplier Device Package: 8-SON; Packaging: Cut Tape (CT); ComponentLink1URL: http://focus.ti.com/lit/ds/symlink/csd16409q3.pdf; ComponentLink1Description: http://focus.ti.com/lit/ds/symlink/csd16409q3.pdf
Q3 = Q_NFET_3.50A_SOT23: MOSFET N-CH 20V 3.5A SOT23-3; Manufacturer: Diodes/Zetex; FET Type: MOSFET N-Channel, Metal Oxide; FET Feature: Logic Level Gate; Rds On (Max) @ Id, Vgs: 55 mOhm @ 3.5A, 4.5V; Gate Charge (Qg) @ Vgs: 11nC @ 4.5V; Input Capacitance (Ciss) @ Vds: 872pF @ 10V; Supplier 1: Digi-Key; Supplier Part Number 1: ZXMN2B14FHCT-ND; RoHS: RoHS Compliant; Category: Discrete Semiconductor Products; Stock 1: 14777; Pricing: 1=0.88, 10=0.764, 100=0.603, 250=0.5226, 500=0.4422, 1000=0.35175 (USD); Drain to Source Voltage (Vdss): 20V; Mounting Type: Surface Mount; Supplier Device Package: SOT-23-3; Packaging: Cut Tape (CT); ComponentLink1URL: http://www.diodes.com/datasheets/ZXMN2B14FH.pdf; ComponentLink1Description: http://www.diodes.com/datasheets/ZXMN2B14FH.pdf
R18 R19 R26 = R_0402_10M: RES SMD 10M OHM 1% 1/16W 0402; Manufacturer: Yageo; Manufacturer Part Number: RC0402FR-0710ML; Temperature Coefficient: ±100ppm/°C; Supplier 1: Digi-Key; RoHS: RoHS Compliant; Category: Resistors; Stock 1: 285948; Pricing 1: 1=0.1, 10=0.015, 25=0.0108, 100=0.006, 250=0.00456, 500=0.00364, 1000=0.00268, 2500=0.00233, 5000=0.00192 (USD); Packaging: Cut Tape (CT); Part Status: Active; Resistance (Ohms): 10M; Composition: Thick Film; Features: Moisture Resistant; Operating Temperature: -55°C ~ 155°C; Package / Case: 0402 (1005 Metric); Supplier Device Package: 0402; Size / Dimension: 0.039" L x 0.020" W (1.00mm x 0.50mm); Height - Seated (Max): 0.016" (0.40mm); Number of Terminations: 2; Failure Rate: -; ComponentLink1URL: http://www.yageo.com/NewPortal/yageodocoutput?fileName=/pdf/R-Chip/PYu-RC_Group_51_RoHS_L_4.pdf; ComponentLink1Description: http://www.yageo.com/NewPortal/yageodocoutput?fileName=/pdf/R-Chip/PYu-RC_Group_51_RoHS_L_4.pdf; Supplier Part Number 1: 311-10.0MLRCT-ND
R20 = R_0402_10.0: RES 10.0 OHM 1/16W 1% 0402 SMD; Manufacturer: Yageo; Manufacturer Part Number: RC0402FR-0710RL; Temperature Coefficient: ±200ppm/°C; Description: RES SMD 10 OHM 1% 1/16W 0402; Supplier 1: Digi-Key; Supplier Part Number 1: 311-10.0LRCT-ND; RoHS: RoHS Compliant; Category: Resistors; Stock 1: 1266033; Composition: Thick Film; Features: Moisture Resistant; Packaging: Cut Tape (CT); ComponentLink1URL: http://www.yageo.com/documents/recent/PYu-RC_Group_51_RoHS_L_7.pdf; ComponentLink1Description: http://www.yageo.com/documents/recent/PYu-RC_Group_51_RoHS_L_7.pdf; Pricing 1: 1=0.1, 10=0.014, 100=0.0056, 1000=0.00253, 2500=0.0022, 5000=0.00181 (USD); Part Status: Active; Operating Temperature: -55°C ~ 155°C; Package / Case: 0402 (1005 Metric); Supplier Device Package: 0402; Size / Dimension: 0.039" L x 0.020" W (1.00mm x 0.50mm); Height - Seated (Max): 0.016" (0.40mm); Failure Rate: -
R21 R25 R29 R31 = R_0402_100.0: RES 100 OHM 1/16W 1% 0402 SMD; Manufacturer: Yageo; Manufacturer Part Number: RC0402FR-07100RL; Temperature Coefficient: ±100ppm/°C; Supplier 1: Digi-Key; RoHS: RoHS Compliant; Category: Resistors; Stock 1: 2051645; Pricing 1: 1=0.1, 10=0.013, 25=0.0096, 100=0.0054, 250=0.00412, 500=0.00328, 1000=0.00242, 2500=0.0021, 5000=0.00173 (USD); Packaging: Cut Tape (CT); Resistance (Ohms): 100; Composition: Thick Film; Features: Moisture Resistant; Operating Temperature: -55°C ~ 155°C; Package / Case: 0402 (1005 Metric); Supplier Device Package: 0402; Size / Dimension: 0.039" L x 0.020" W (1.00mm x 0.50mm); Height: 0.016" (0.40mm); Number of Terminations: 2; ComponentLink1URL: http://www.yageo.com/documents/recent/PYu-RC_Group_51_RoHS_L_2.pdf; ComponentLink1Description: http://www.yageo.com/documents/recent/PYu-RC_Group_51_RoHS_L_2.pdf; Supplier Part Number 1: 311-100LRCT-ND
R22 R23 R30 = R_0402_5.11K: RES 5.11K OHM 1/10W 1% 0402 SMD; Manufacturer: Panasonic - ECG; Manufacturer Part Number: ERJ-2RKF5111X; Temperature Coefficient: ±100ppm/°C; Supplier 1: Digi-Key; Supplier Part Number 1: P5.11KLCT-ND; RoHS: RoHS Compliant; Category: Resistors; Stock 1: 491807; Pricing: 1=0.06, 50=0.0242, 100=0.0184, 250=0.01364, 500=0.01008, 1000=0.00672, 5000=0.00473 (USD); Resistance (Ohms): 5.11K; Composition: Thick Film; Features: -; Size / Dimension: 0.039" L x 0.020" W (1.00mm x 0.50mm); Height: 0.014" (0.35mm); Number of Terminations: 2; Packaging: Cut Tape (CT); Package / Case: 0402 (1005 Metric); ComponentLink1URL: http://industrial.panasonic.com/www-cgi/jvcr13pz.cgi?E+PZ+3+AOA0002+ERJ2RKF5111X+7+WW; ComponentLink1Description: http://industrial.panasonic.com/www-cgi/jvcr13pz.cgi?E+PZ+3+AOA0002+ERJ2RKF5111X+7+WW
R24 = R_0402_10.0K: RES 10.0K OHM 1/16W 1% 0402 SMD; Manufacturer: Stackpole Electronics Inc; Manufacturer Part Number: RMCF0402FT10K0; Resistance (Ohms): 10k; Temperature Coefficient: ±100ppm/°C; Supplier 1: Digi-Key; Supplier Part Number 1: RMCF0402FT10K0CT-ND; RoHS: RoHS Compliant; Category: Resistors; Stock 1: 234525; Pricing: 1=0.04, 10=0.025, 50=0.0138, 100=0.0105, 250=0.0078, 500=0.00576, 1000=0.00384, 2500=0.00324, 5000=0.0027 (USD); Composition: Thick Film; Features: -; Package / Case: 0402 (1005 Metric); Size / Dimension: 0.039" L x 0.020" W (1.00mm x 0.50mm); Height: 0.016" (0.40mm); Number of Terminations: 2; Packaging: Cut Tape (CT); ComponentLink1URL: http://www.seielect.com/Catalog/SEI-RMCF_RMCP.pdf; ComponentLink1Description: http://www.seielect.com/Catalog/SEI-RMCF_RMCP.pdf
R27 = R_0402_100.0K: RES 100K OHM 1/16W 1% 0402 SMD; Manufacturer: Stackpole Electronics Inc; Manufacturer Part Number: RMCF0402FT100K; Temperature Coefficient: ±100ppm/°C; RoHS: RoHS Compliant; Category: Resistors; Composition: Thick Film; Features: -; Lead Style: Surface Mount (SMD - SMT); Packaging: Cut Tape (CT); Resistance (Ohms): 100k; Package / Case: 0402 (1005 Metric); Supplier Device Package: 0402; Size / Dimension: 0.039" L x 0.020" W (1.00mm x 0.50mm); Height: 0.016" (0.40mm); Number of Terminations: 2; Supplier 1: Digi-Key; Supplier Part Number 1: RMCF0402FT100KCT-ND; Stock 1: 18746; Pricing: 1=0.04, 10=0.025, 50=0.0138, 100=0.0105, 250=0.0078, 500=0.00576, 1000=0.00384, 2500=0.00324, 5000=0.0027 (USD); ComponentLink1URL: http://www.seielect.com/Catalog/SEI-RMCF_RMCP.pdf; ComponentLink1Description: http://www.seielect.com/Catalog/SEI-RMCF_RMCP.pdf
R28 = R_0402_1.00: RES 1.00 OHM 1/16W 1% 0402 SMD; Manufacturer: Yageo; Manufacturer Part Number: RC0402FR-071RL; Resistance (Ohms): 1; Temperature Coefficient: ±200ppm/°C; Supplier 1: Digi-Key; RoHS: RoHS Compliant; Category: Resistors; Stock 1: 426521; Pricing 1: 1=0.1, 10=0.02, 25=0.0144, 100=0.0082, 250=0.00624, 500=0.00498, 1000=0.00367, 2500=0.00319, 5000=0.00263 (USD); Packaging: Cut Tape (CT); Composition: Thick Film; Features: Moisture Resistant; Operating Temperature: -55°C ~ 155°C; Package / Case: 0402 (1005 Metric); Supplier Device Package: 0402; Size / Dimension: 0.039" L x 0.020" W (1.00mm x 0.50mm); Height: 0.016" (0.40mm); Number of Terminations: 2; ComponentLink1URL: http://www.yageo.com/NewPortal/yageodocoutput?fileName=/pdf/R-Chip/PYu-RC_Group_51_RoHS_L_3.pdf; ComponentLink1Description: http://www.yageo.com/NewPortal/yageodocoutput?fileName=/pdf/R-Chip/PYu-RC_Group_51_RoHS_L_3.pdf; Supplier Part Number 1: 311-1.00LRCT-ND
R32 = R_1206_10: RES SMD 10 OHM 1% 1/4W 1206; Manufacturer: Yageo; Manufacturer Part Number: RC1206FR-0710RL; Temperature Coefficient: ±200ppm/°C; Supplier 1: Digi-Key; RoHS: RoHS Compliant; Category: Resistors; Stock 1: 1422829; Pricing 1: 1=0.1, 10=0.032, 25=0.0232, 100=0.013, 250=0.00992, 500=0.00792, 1000=0.00583, 2500=0.00506 (USD); Packaging: Cut Tape (CT); Part Status: Active; Resistance (Ohms): 10; Composition: Thick Film; Features: Moisture Resistant; Operating Temperature: -55°C ~ 155°C; Package / Case: 1206 (3216 Metric); Supplier Device Package: 1206; Size / Dimension: 0.122" L x 0.063" W (3.10mm x 1.60mm); Height - Seated (Max): 0.026" (0.65mm); Number of Terminations: 2; Failure Rate: -; ComponentLink1URL: http://www.yageo.com/NewPortal/yageodocoutput?fileName=/pdf/R-Chip/PYu-RC_Group_51_RoHS_L_4.pdf; ComponentLink1Description: http://www.yageo.com/NewPortal/yageodocoutput?fileName=/pdf/R-Chip/PYu-RC_Group_51_RoHS_L_4.pdf; Supplier Part Number 1: 311-10.0FRCT-ND
R33 R35 = R_0402_0.00: RES SMD 0.0OHM JUMPER 1/10W 0402; Manufacturer: Panasonic - ECG; Manufacturer Part Number: ERJ-2GE0R00X; Resistance (Ohms): 0.0; Supplier 1: Digi-Key; Supplier Part Number 1: P0.0JCT-ND; RoHS: RoHS Compliant; Category: Resistors; Stock 1: 9828264; Pricing: 1=0.05, 50=0.0172, 100=0.0131, 250=0.00976, 500=0.0072, 1000=0.0048, 5000=0.00338 (USD); Composition: Thick Film; Features: -; Temperature Coefficient: -; Package / Case: 0402 (1005 Metric); Size / Dimension: 0.039" L x 0.020" W (1.00mm x 0.50mm); Height: 0.016" (0.40mm); Number of Terminations: 2; Packaging: Cut Tape (CT); ComponentLink1URL: http://industrial.panasonic.com/www-cgi/jvcr13pz.cgi?E+PZ+3+AOA0001+ERJ2GE0R00X+7+WW; ComponentLink1Description: http://industrial.panasonic.com/www-cgi/jvcr13pz.cgi?E+PZ+3+AOA0001+ERJ2GE0R00X+7+WW
R34 = R_1206_0.005: RES SMD 0.005 OHM 1% 1W 1206; Manufacturer: Stackpole Electronics Inc.; Manufacturer Part Number: CSRF1206FT5L00; Temperature Coefficient: ±100ppm/°C; Supplier 1: Digi-Key; RoHS: RoHS Compliant; Category: Resistors; Stock 1: 42538; Pricing 1: 1=0.63, 10=0.468, 50=0.33, 100=0.2723, 250=0.23652, 500=0.1925, 1000=0.15268 (USD); Packaging: Cut Tape (CT); Part Status: Active; Resistance (Ohms): 0.005; Composition: Metal Foil; Features: Automotive AEC-Q200, Current Sense, Moisture Resistant; Operating Temperature: -55°C ~ 170°C; Package / Case: 1206 (3216 Metric); Supplier Device Package: 1206; Size / Dimension: 0.126" L x 0.063" W (3.20mm x 1.60mm); Height - Seated (Max): 0.033" (0.85mm); Number of Terminations: 2; Failure Rate: -; ComponentLink1URL: https://www.seielect.com/Catalog/SEI-csrf.pdf; ComponentLink1Description: https://www.seielect.com/Catalog/SEI-csrf.pdf; Supplier Part Number 1: CSRF1206FT5L00CT-ND
R36 = R_0.010SENSE_LK20: RES SMD 0.01 OHM 1% 2W 1224; Manufacturer: Ohmite; Manufacturer Part Number: LVK25R010FER; Resistance (Ohms): 0.01; Temperature Coefficient: ±100ppm/°C; Supplier 1: Digi-Key; RoHS: RoHS Compliant; Category: Resistors; Stock 1: 3676; Pricing 1: 1=1.77, 10=1.571, 25=1.4564, 50=1.3706, 100=1.1994, 250=1.028, 500=0.85668 (USD); Packaging: Cut Tape (CT); Composition: Thick Film; Features: Current Sense, Moisture Resistant; Operating Temperature: -40°C ~ 125°C; Package / Case: Wide 2412 (6231 Metric), 1224; Supplier Device Package: 1224; Size / Dimension: 0.126" L x 0.252" W (3.20mm x 6.40mm); Height: 0.028" (0.70mm); Number of Terminations: 4; ComponentLink1URL: http://www.ohmite.com/cat/res_lvk.pdf; ComponentLink1Description: http://www.ohmite.com/cat/res_lvk.pdf; Supplier Part Number 1: LVK25R010FERCT-ND
R37 = R_0402_330K: RES SMD 330K OHM 1% 1/16W 0402; Manufacturer: Yageo; Manufacturer Part Number: RC0402FR-07330KL; Temperature Coefficient: ±100ppm/°C; Supplier 1: Digi-Key; RoHS: RoHS Compliant; Category: Resistors; Stock 1: 135846; Pricing 1: 1=0.1, 10=0.013, 25=0.0096, 100=0.0054, 250=0.00412, 500=0.00328, 1000=0.00242, 2500=0.0021, 5000=0.00173 (USD); Packaging: Cut Tape (CT); Part Status: Active; Resistance (Ohms): 330k; Composition: Thick Film; Features: Moisture Resistant; Operating Temperature: -55°C ~ 155°C; Package / Case: 0402 (1005 Metric); Supplier Device Package: 0402; Size / Dimension: 0.039" L x 0.020" W (1.00mm x 0.50mm); Height - Seated (Max): 0.016" (0.40mm); Number of Terminations: 2; Failure Rate: -; ComponentLink1URL: http://www.yageo.com/NewPortal/yageodocoutput?fileName=/pdf/R-Chip/PYu-RC_Group_51_RoHS_L_4.pdf; ComponentLink1Description: http://www.yageo.com/NewPortal/yageodocoutput?fileName=/pdf/R-Chip/PYu-RC_Group_51_RoHS_L_4.pdf; Supplier Part Number 1: 311-330KLRCT-ND
R38-R41 = R_0402_NTC_10.0K: NTC Thermistor 10k 0402 (1005 Metric); Manufacturer: Murata Electronics North America; Manufacturer Part Number: NCP15XH103F03RC; B25/50: 3380K; B25/85: 3434K; B25/100: 3455K; Power - Max: 100mW; Supplier 1: Digi-Key; RoHS: RoHS Compliant; Category: Sensors, Transducers; Stock 1: 119531; Pricing 1: 1=0.13, 10=0.107, 25=0.0988, 50=0.0792, 100=0.0678, 250=0.0622, 500=0.05936, 1000=0.05089, 2500=0.04806 (USD); Packaging: Cut Tape (CT); Part Status: Active; Resistance in Ohms @ 25°C: 10k; Resistance Tolerance: ±1%; B Value Tolerance: ±1%; B0/50: -; B25/75: -; Operating Temperature: -40°C ~ 125°C; Length - Lead Wire: -; Mounting Type: Surface Mount; Package / Case: 0402 (1005 Metric); ComponentLink1URL: http://www.murata.com/~/media/webrenewal/support/library/catalog/products/thermistor/ntc/r44e.ashx; ComponentLink1Description: http://www.murata.com/~/media/webrenewal/support/library/catalog/products/thermistor/ntc/r44e.ashx; Supplier Part Number 1: 490-4801-1-ND
R42 = R_0402_26.1K: RES SMD 26.1K OHM 1% 1/16W 0402; Manufacturer: Stackpole Electronics Inc.; Manufacturer Part Number: RMCF0402FT26K1; Temperature Coefficient: ±100ppm/°C; Supplier 1: Digi-Key; RoHS: RoHS Compliant; Category: Resistors; Stock 1: 20120; Pricing 1: 1=0.1, 10=0.02, 50=0.011, 100=0.0081, 250=0.0062, 500=0.00496, 1000=0.00364, 2500=0.00316, 5000=0.00261 (USD); Packaging: Cut Tape (CT); Part Status: Active; Resistance (Ohms): 26.1k; Composition: Thick Film; Features: Automotive AEC-Q200; Operating Temperature: -55°C ~ 155°C; Package / Case: 0402 (1005 Metric); Supplier Device Package: 0402; Size / Dimension: 0.039" L x 0.020" W (1.00mm x 0.50mm); Height - Seated (Max): 0.016" (0.40mm); Number of Terminations: 2; Failure Rate: -; ComponentLink1URL: https://www.seielect.com/Catalog/SEI-RMCF_RMCP.pdf; ComponentLink1Description: https://www.seielect.com/Catalog/SEI-RMCF_RMCP.pdf; Supplier Part Number 1: RMCF0402FT26K1CT-ND
U1 = U_BQ40Z60RHBR: IC BATTERY MANAGER 32VQFN; Battery Chemistry: Lithium-Ion/Polymer; Number of Cells: 2 ~ 4; Fault Protection: Over Current, Short Circuit; Voltage - Supply (Max): 26V; Interface: SMBus; RoHS: RoHS Compliant; Supplier 1: Digi-Key; Category: Integrated Circuits (ICs); Stock 1: 2505; Pricing 1: 1=7.63, 10=6.918, 100=5.7023 (USD); Packaging: Cut Tape (CT); Part Status: Active; Current - Charging: -; Programmable Features: -; Charge Current - Max: -; Battery Pack Voltage: -; Operating Temperature: -40°C ~ 85°C (TA); Package / Case: 32-VFQFN Exposed Pad; Supplier Device Package: 32-VQFN (5x5); ComponentLink1URL: http://www.ti.com/lit/ds/symlink/bq40z60.pdf; ComponentLink1Description: http://www.ti.com/lit/ds/symlink/bq40z60.pdf; Supplier Part Number 1: 296-38618-1-ND